# Altium schematic sheet AU0005A_TOP_LEVEL.SchDoc
size D; Organization: Altium Limited; Address1: 3 Minna Close; Address2: Belrose; Address3: NSW 2085; Address4: Australia; DocumentNumber: 1; SheetNumber: 1; SheetTotal: 1; PAGE_TITLE: TOP LEVEL
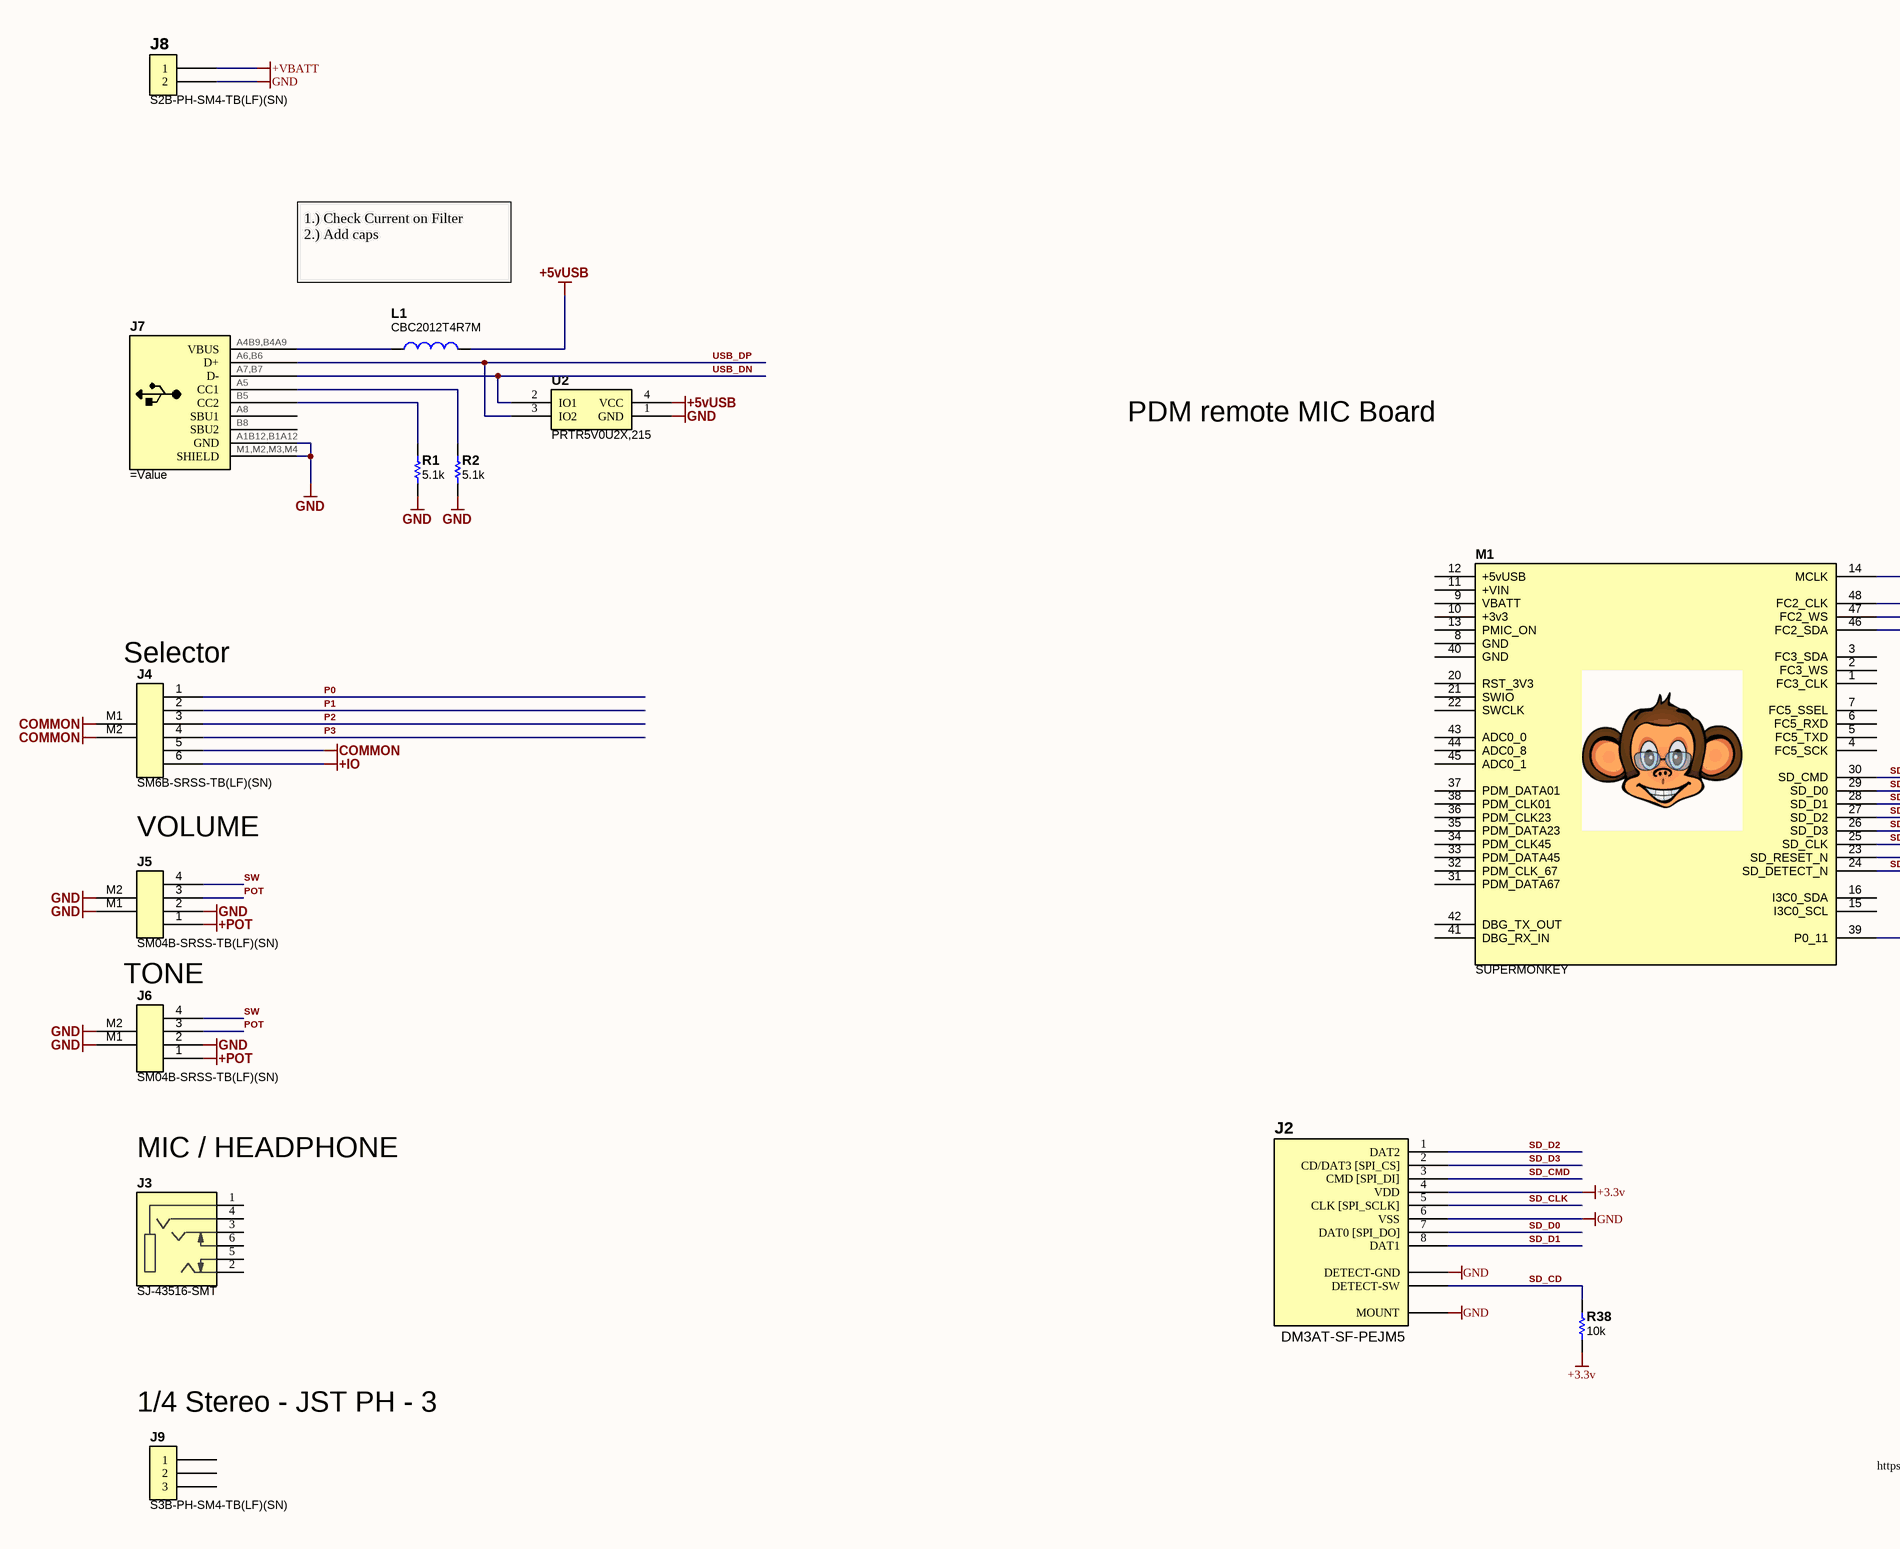
[diagram p0: AU0005A_TOP_LEVEL.SchDoc, left]
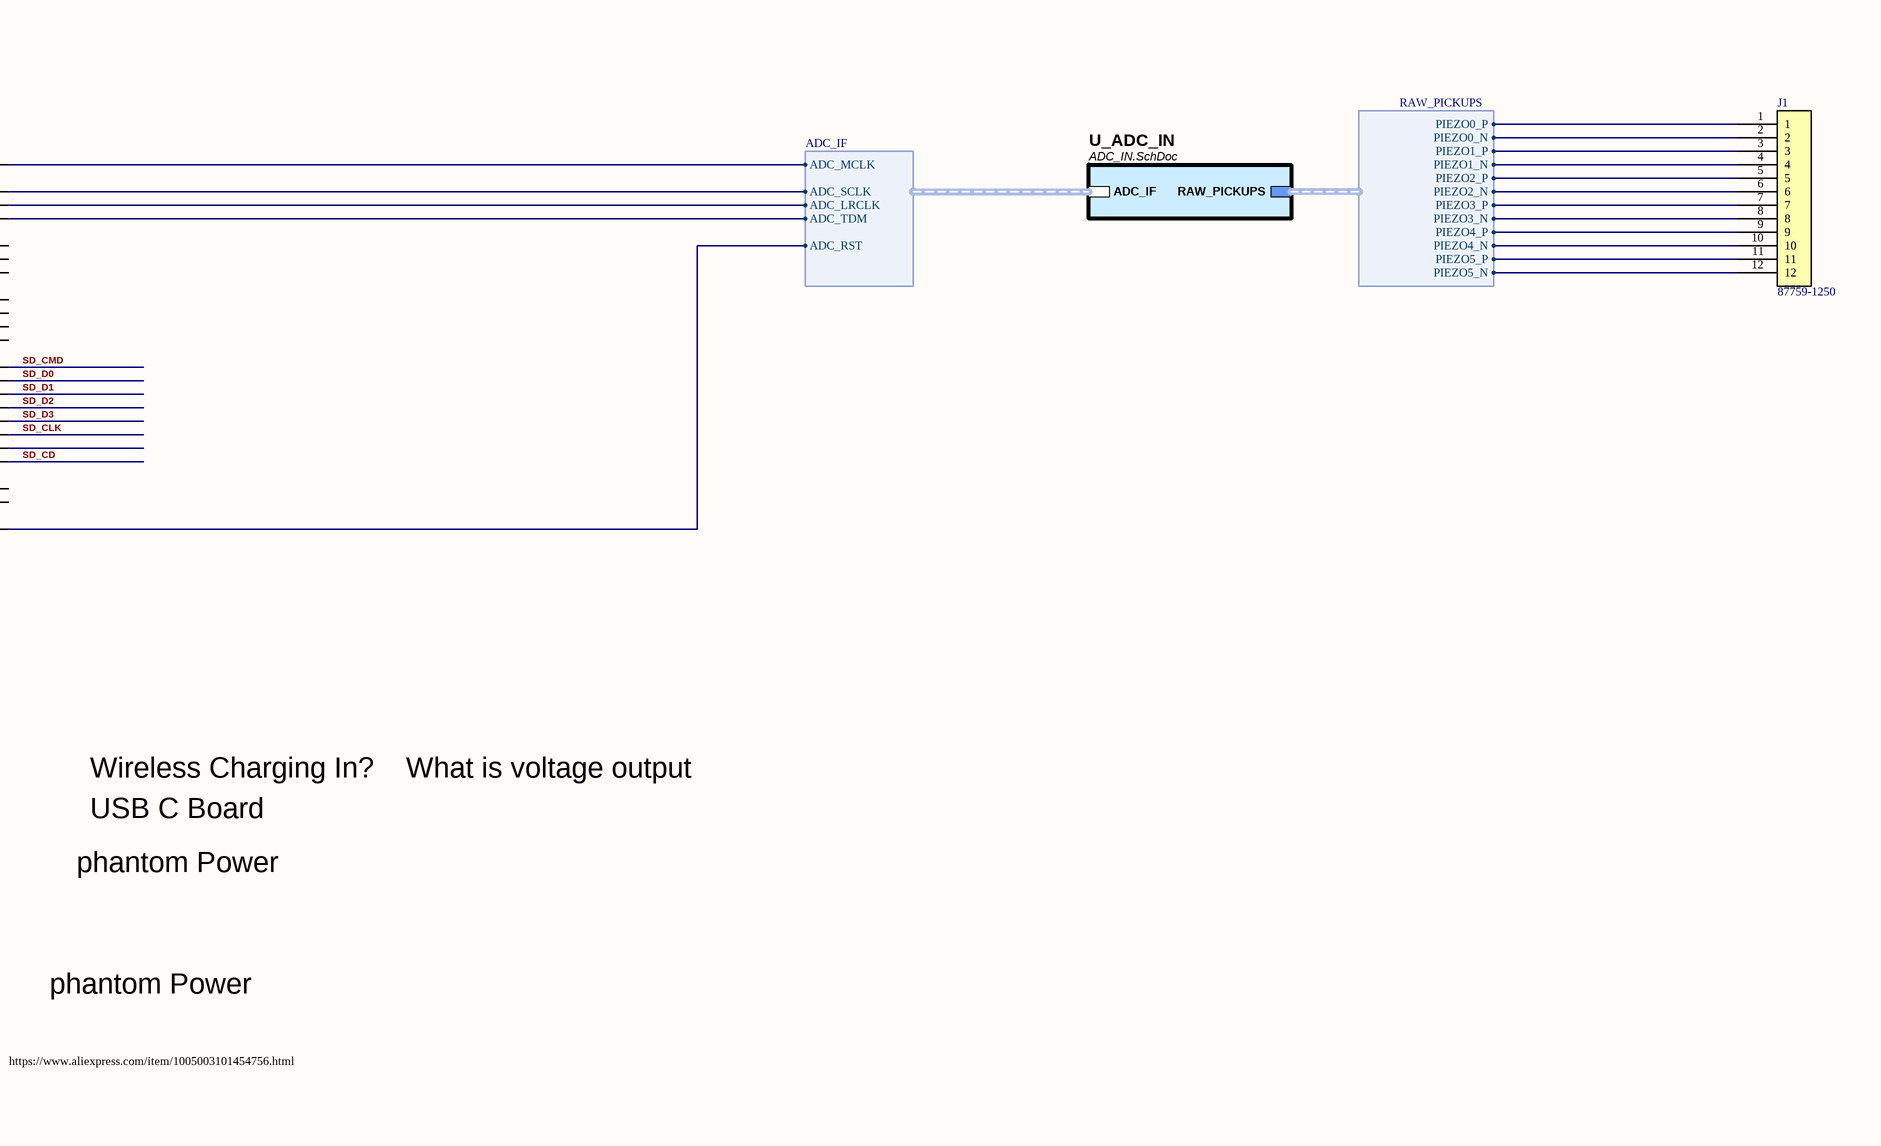
[diagram p1: AU0005A_TOP_LEVEL.SchDoc, right]

## Parts
J1  87759-1250  [87759-1250]
J2  DM3AT-SF-PEJM5  [DM3AT-SF-PEJM5]
J3  SJ-43516-SMT  [CUI_SJ-43516-SMT]
J4  SM6B-SRSS-TB(LF)(SN)  [SM06B-SRSS-TB(LF)(SN)]
J5  SM04B-SRSS-TB(LF)(SN)  [SM04B-SRSS-TB(LF)(SN)]
J6  SM04B-SRSS-TB(LF)(SN)  [SM04B-SRSS-TB(LF)(SN)]
J7  (no value)  [12402012E212A]
J8  S2B-PH-SM4-TB(LF)(SN)  [S2B-PH-SM4-TB(LF)(SN)]
J9  S3B-PH-SM4-TB(LF)(SN)  [S3B-PH-SM4-TB(LF)(SN)]
L1  CBC2012T4R7M  [C0805_1.45MM_MD]
M1  SUPERMONKEY  [SUPERMONKEY]
R1  5.1k  [R0603_0.55MM_MD]
R2  5.1k  [R0603_0.55MM_MD]
R38  10k  [R0402_0.40MM_MD]
U2  PRTR5V0U2X,215  [SOT143B]

## Sub-sheets
U_ADC_IN = ADC_IN.SchDoc: RAW_PICKUPS (harness RAW_PICKUPS), ADC_IF (harness ADC_IF)

## Harnesses
ADC_IF: ADC_MCLK, ADC_LRCLK, ADC_SCLK, ADC_TDM, ADC_RST
RAW_PICKUPS: PIEZO0_N, PIEZO0_P, PIEZO1_P, PIEZO1_N, PIEZO2_P, PIEZO2_N, PIEZO3_P, PIEZO3_N, PIEZO4_P, PIEZO4_N, PIEZO5_P, PIEZO5_N

## Nets
+3.3v: J2.4(VDD) R38.1
+5vUSB: L1.2 U2.4(VCC)
+IO: J4.6
+POT: J5.1 J6.1
+VBATT: J8.1
COMMON: J4.5 J4.M1 J4.M2
GND: J2.6(VSS) J2.CDA(DETECT-GND) J2.M(MOUNT) J5.2 J5.M1 J5.M2 J6.2 J6.M1 J6.M2 J7.A1B12,B1A12(GND) J7.M1,M2,M3,M4(SHIELD) J8.2 R1.1 R2.1 U2.1(GND)
P0: J4.1
P1: J4.2
P2: J4.3
P3: J4.4
POT: J5.3 J6.3
SD_CD: J2.CDB(DETECT-SW) M1.24(SD_DETECT_N) R38.2
SD_CLK: J2.5(CLK_[SPI_SCLK]) M1.25(SD_CLK)
SD_CMD: J2.3(CMD_[SPI_DI]) M1.30(SD_CMD)
SD_D0: J2.7(DAT0_[SPI_DO]) M1.29(SD_D0)
SD_D1: J2.8(DAT1) M1.28(SD_D1)
SD_D2: J2.1(DAT2) M1.27(SD_D2)
SD_D3: J2.2(CD/DAT3_[SPI_CS]) M1.26(SD_D3)
SW: J5.4 J6.4
USB_DN: J7.A7,B7(D-) U2.2(IO1)
USB_DP: J7.A6,B6(D+) U2.3(IO2)
NetJ1_1: J1.1 ; sheet U_ADC_IN/RAW_PICKUPS.PIEZO0_P
NetJ1_2: J1.2 ; sheet U_ADC_IN/RAW_PICKUPS.PIEZO0_N
NetJ1_3: J1.3 ; sheet U_ADC_IN/RAW_PICKUPS.PIEZO1_P
NetJ1_4: J1.4 ; sheet U_ADC_IN/RAW_PICKUPS.PIEZO1_N
NetJ1_5: J1.5 ; sheet U_ADC_IN/RAW_PICKUPS.PIEZO2_P
NetJ1_6: J1.6 ; sheet U_ADC_IN/RAW_PICKUPS.PIEZO2_N
NetJ1_7: J1.7 ; sheet U_ADC_IN/RAW_PICKUPS.PIEZO3_P
NetJ1_8: J1.8 ; sheet U_ADC_IN/RAW_PICKUPS.PIEZO3_N
NetJ1_9: J1.9 ; sheet U_ADC_IN/RAW_PICKUPS.PIEZO4_P
NetJ1_10: J1.10 ; sheet U_ADC_IN/RAW_PICKUPS.PIEZO4_N
NetJ1_11: J1.11 ; sheet U_ADC_IN/RAW_PICKUPS.PIEZO5_P
NetJ1_12: J1.12 ; sheet U_ADC_IN/RAW_PICKUPS.PIEZO5_N
NetJ7_A4B9,B4A9: J7.A4B9,B4A9(VBUS) L1.1
NetJ7_A5: J7.A5(CC1) R2.2
NetJ7_B5: J7.B5(CC2) R1.2
NetM1_14: M1.14(MCLK) ; sheet U_ADC_IN/ADC_IF.ADC_MCLK
NetM1_39: M1.39(P0_11) ; sheet U_ADC_IN/ADC_IF.ADC_RST
NetM1_46: M1.46(FC2_SDA) ; sheet U_ADC_IN/ADC_IF.ADC_TDM
NetM1_47: M1.47(FC2_WS) ; sheet U_ADC_IN/ADC_IF.ADC_LRCLK
NetM1_48: M1.48(FC2_CLK) ; sheet U_ADC_IN/ADC_IF.ADC_SCLK

Not connected (* = marked no-connect by the designer): J3 1(SLEEVE) 2(TIP) 3(RING1) 4(RING2) 5(TIP_SWITCH) 6(RING_SWITCH); J7 A8(SBU1) B8(SBU2); J9 1 2 3; M1 1(FC3_CLK) 2(FC3_WS) 3(FC3_SDA) 4(FC5_SCK) 5(FC5_TXD) 6(FC5_RXD) 7(FC5_SSEL) 8(GND) 9(VBATT) 10(+3v3) 11(+VIN) 12(+5vUSB) 13(PMIC_ON) 15(I3C0_SCL) 16(I3C0_SDA) 20(RST_3V3) 21(SWIO) 22(SWCLK) 23(SD_RESET_N) 31(PDM_DATA67) 32(PDM_CLK_67) 33(PDM_DATA45) 34(PDM_CLK45) 35(PDM_DATA23) 36(PDM_CLK23) 37(PDM_DATA01) 38(PDM_CLK01) 40(GND) 41(DBG_RX_IN) 42(DBG_TX_OUT) 43(ADC0_0) 44(ADC0_8) 45(ADC0_1)

## Notes on the sheet
- 1.) Check Current on Filter
  2.) Add caps
- PDM remote MIC Board
- (near J4) Selector
- VOLUME
- TONE
- (near J3) MIC / HEADPHONE
- Wireless Charging In?    What is voltage output
- USB C Board
- phantom Power
- (near J9) 1/4 Stereo - JST PH - 3
- https://www.aliexpress.com/item/1005003101454756.html
- PCB REV
- CCA REV
- Sheet
- of

## Library data of the parts
J1 = 87759-1250: CONN HEADER 12POS 2MM VERT SMD; Manufacturer: Molex Connector Corporation; Connector Type: Header, Unshrouded; Number of Positions: 12; Number of Positions Loaded: All; Pitch: 0.079" (2.00mm); Value: 87759-1250; Supplier 1: Digi-Key; Supplier Part Number 1: WM18653-ND; Manufacturer Part Number: 87759-1250; RoHS: RoHS Compliant; Category: Connectors, Interconnects; Stock 1: 1595; Pricing 1: 1=2.07, 10=1.823, 100=1.2155, 500=0.9724, 1000=0.80709 (USD); Contact Type: Male Pin; Number of Rows: 2; Row Spacing: 0.079" (2.00mm); Contact Mating Length: 0.150" (3.81mm); Mounting Type: Surface Mount; Termination: Solder; Fastening Type: -; Features: Board Guide; Contact Finish: Gold; Contact Finish Thickness: 15µin (0.38µm); Color: Black; Packaging: Tube; ComponentLink1URL: http://www.molex.com/pdm_docs/sd/877591250_sd.pdf; ComponentLink1Description: http://www.molex.com/pdm_docs/sd/877591250_sd.pdf
J2 = DM3AT-SF-PEJM5: CONN MICRO SD R/A PUSH-PUSH SMD; Manufacturer: Hirose Electric Co Ltd; Card Type: Secure Digital - microSD™; Number of Positions: 10 (8 + 2); Connector Type: Connector and Ejector; Insertion, Removal Method: Push In, Push Out; Supplier 1: Digi-Key; Supplier Part Number 1: HR1964CT-ND; Manufacturer Part Number: DM3AT-SF-PEJM5; RoHS: RoHS Compliant; Category: Connectors, Interconnects; Stock: 28699; Pricing: 1=2.83, 10=2.72, 25=2.4932, 50=2.3798, 100=2.2664, 250=1.98312, 500=1.92648 (USD); Packaging: Cut Tape (CT); Ejector Side: -; Mounting Type: Surface Mount, Right Angle; Features: Switch; Height Above Board: 0.066" (1.68mm); Mounting Feature: Normal, Standard - Top; Contact Finish: Gold; Contact Finish Thickness: -; ComponentLink1URL: http://www.hirose.co.jp/cataloge_hp/e60900232.pdf; ComponentLink1Description: http://www.hirose.co.jp/cataloge_hp/e60900232.pdf; Value: DM3AT-SF-PEJM5
J3 = SJ-43516-SMT: Conn 3.5MM Audio Jack F 6 POS Solder RA SMD 6 Terminal 1 Port; Manufacturer: CUI Devices; Manufacturer Part Number: SJ-43516-SMT-TR; Value: SJ-43516-SMT; Package: 3.5MM SMD R/A; Price: $1.24; Availability: Available
J4 = SM06B-SRSS-TB(LF)(SN): 6 Positions Header, Shrouded Connector 0.039" (1.00mm) Surface Mount, Right Angle Tin; Manufacturer: JST; Number of Positions: 6; Connector Type: Male Pin; Contact Resistance: 40mR; Pitch: 1mm; Current Rating: 1A; Voltage Rating (AC): 50V; Insulation Resistance: 100MR; Gender: Male; Value: SM6B-SRSS-TB(LF)(SN); Supplier 1: Digi-Key; Manufacturer Part Number: SM06B-SRSS-TB(LF)(SN); Stock 1: 40560; Pricing 1: 1=0.83, 10=0.782, 100=0.5996, 500=0.5214, 1000=0.4301 (USD); Mount: Surface Mount; Contact Material: Copper,Copper Alloy; Contact Plating: Copper,Tin,Lead; Colour: Natural; Housing Colour: Beige; Housing Material: Polyamide; Min Operating Temperature: -25°C; Max Operating Temperature: 85°C; Number of Rows: 1; Termination: Solder; Packaging: Tape and Reel; Orientation: Right Angle; Number of Contacts: 6; Lead Free: Lead Free; ComponentLink1URL: https://datasheet.ciiva.com/11752/0900766b8082f544-11752176.pdf; ComponentLink1Description: https://datasheet.ciiva.com/11752/0900766b8082f544-11752176.pdf; ComponentLink2URL: https://datasheet.ciiva.com/16217/sm06b-srss-tblfsn-16217552.pdf; ComponentLink2Description: https://datasheet.ciiva.com/16217/sm06b-srss-tblfsn-16217552.pdf; ComponentLink3URL: https://datasheet.ciiva.com/26894/getdatasheetpartid-490708-26894951.pdf; ComponentLink3Description: https://datasheet.ciiva.com/26894/getdatasheetpartid-490708-26894951.pdf; Supplier Part Number 1: 455-1806-1-ND; Material: Polyamide; Voltage Rating: 50V; Lead Pitch: 1mm; REACH SVHC: No SVHC; Flammability Rating: UL94 V-0; ComponentLink4URL: https://datasheet.ciiva.com/26894/getdatasheetpartid-639890-26894680.pdf; ComponentLink4Description: https://datasheet.ciiva.com/26894/getdatasheetpartid-639890-26894680.pdf; ComponentLink5URL: https://datasheet.ciiva.com/8052/91630-8052281.pdf; ComponentLink5Description: https://datasheet.ciiva.com/8052/91630-8052281.pdf; ComponentLink6URL: https://datasheet.ciiva.com/712/esr-712571.pdf; ComponentLink6Description: https://datasheet.ciiva.com/712/esr-712571.pdf; Max Current Rating: 1A; Max Voltage Rating (AC): 50V; Max Voltage Rating (DC): 50V; Length: 8mm; Depth: 4.95mm; ComponentLink7URL: https://datasheet.ciiva.com/712/esr-712572.pdf; ComponentLink7Description: https://datasheet.ciiva.com/712/esr-712572.pdf; ComponentLink8URL: https://datasheet.ciiva.com/730/esr-730671.pdf; ComponentLink8Description: https://datasheet.ciiva.com/730/esr-730671.pdf
J5 J6 = SM04B-SRSS-TB(LF)(SN): Conn Shrouded Header HDR 4 POS 1mm Solder RA SMD T/R; Manufacturer: JST; Number of Positions: 4; Connector Type: Male Pin; Contact Resistance: 40mR; Max Current Rating: 1A; Max Voltage Rating (AC): 50V; Pitch: 0.039inch; Value: SM04B-SRSS-TB(LF)(SN); Supplier 1: Digi-Key; Manufacturer Part Number: SM04B-SRSS-TB(LF)(SN); Stock 1: 43886; Pricing 1: 1=0.61, 10=0.569, 100=0.436, 500=0.37914, 1000=0.31279 (USD); Mount: Surface Mount; Contact Material: Copper Alloy; Contact Plating: Copper,Tin; Colour: Natural; Housing Colour: Beige; Housing Material: Polyamide; Min Operating Temperature: -25°C; Max Operating Temperature: 85°C; Number of Rows: 1; Termination: Solder; Packaging: Tape and Reel; Orientation: Right Angle; Number of Contacts: 4; Max Voltage Rating (DC): 50V; Length: 6mm; Depth: 4.95mm; Lead Free: Lead Free; ComponentLink1URL: https://datasheet.ciiva.com/26894/getdatasheetpartid-499363-26894945.pdf; ComponentLink1Description: https://datasheet.ciiva.com/26894/getdatasheetpartid-499363-26894945.pdf; ComponentLink2URL: https://datasheet.ciiva.com/26894/getdatasheetpartid-640736-26894676.pdf; ComponentLink2Description: https://datasheet.ciiva.com/26894/getdatasheetpartid-640736-26894676.pdf; ComponentLink3URL: https://datasheet.ciiva.com/16487/jstsm04b-srss-tb-lf-sn-16487222.pdf; ComponentLink3Description: https://datasheet.ciiva.com/16487/jstsm04b-srss-tb-lf-sn-16487222.pdf; Supplier Part Number 1: 455-1804-1-ND
J7 = 12402012E212A: Manufacturer: Amphenol; Supplier 1: Mouser; Supplier Part Number 1: 523-12402012E212A; Manufacturer Part Number: 12402012E212A; RoHS: No; Category: Connectors; Stock 1: 6869; Pricing: 1=0.98000, 10=0.77400, 50=0.77400, 100=0.67300, 1000=0.53800, 10000=0.43700 (USD)
J8 = S2B-PH-SM4-TB(LF)(SN): CONN HEADER PH SIDE 2POS 2MM SMD; Manufacturer: JST Sales America Inc; Connector Type: Header, Shrouded; Number of Positions: 2; Number of Positions Loaded: All; Pitch: 0.079" (2.00mm); Value: S2B-PH-SM4-TB(LF)(SN); Supplier 1: Digi-Key; Supplier Part Number 1: 455-1749-1-ND; Manufacturer Part Number: S2B-PH-SM4-TB(LF)(SN); RoHS: RoHS Compliant; Category: Connectors, Interconnects; Stock 1: 17700; Pricing 1: 1=0.5, 10=0.457, 100=0.3809, 500=0.3047 (USD); Contact Type: Male Pin; Number of Rows: 1; Row Spacing: -; Contact Mating Length: -; Mounting Type: Surface Mount, Right Angle; Termination: Solder; Fastening Type: -; Features: Solder Retention; Contact Finish: Tin; Contact Finish Thickness: -; Color: Natural; Packaging: Cut Tape (CT); ComponentLink1URL: http://www.jst-mfg.com/product/pdf/eng/ePH.pdf; ComponentLink1Description: http://www.jst-mfg.com/product/pdf/eng/ePH.pdf
J9 = S3B-PH-SM4-TB(LF)(SN): CONN HEADER PH SIDE 3POS 2MM SMD; Manufacturer: JST Sales America Inc; Value: S3B-PH-SM4-TB(LF)(SN); Manufacturer Part Number: S3B-PH-SM4-TB(LF)(SN)
L1 = CBC2012T4R7M: FIXED IND 4.7UH 520MA 650 MOHM; Manufacturer: Taiyo Yuden; Core Material: Ferrite; Tolerance: 20%; Self Resonant Frequency: 45MHz; DC Resistance (DCR): 650mR; Test Frequency: 7.96MHz; Saturation Current: 360mA; Shielding: Unshielded; Value: CBC2012T4R7M; Supplier 1: Digi-Key; Manufacturer Part Number: CBC2012T4R7M; Stock 1: 7720; Pricing 1: 1=0.24000, 10=0.21600, 100=0.14860, 500=0.12702, 1000=0.09729 (USD); RoHS: Yes; Mount: Surface Mount; Case/Package: 0805; Number of Pins: 2; Case Code (Metric): 2012; Case Code (Imperial): 0805; Min Operating Temperature: -40°C; Max Operating Temperature: 105°C; Packaging: Tape and Reel; Inductance: 4.7uH; Max DC Current: 520mA; Termination: SMD/SMT; Inductance Tolerance: 20%; Package Quantity: 3000; Current Rating: 520mA; Composition: Wirewound; Length: 0.079inch; Height: 1.25mm; Width: 0.049inch; Height - Seated (Max): 0.057inch; REACH SVHC: No SVHC; Lead Free: Exempt; Halogen Free: Halogen Free; ComponentLink1URL: https://datasheet.ciiva.com/15981/214cbc2012t4r7m-15981637.pdf?src-supplier=Onlinecomponents.com; ComponentLink1Description: https://datasheet.ciiva.com/15981/214cbc2012t4r7m-15981637.pdf?src-supplier=Onlinecomponents.com; ComponentLink2URL: https://datasheet.ciiva.com/1040/cbc2012t4r7m-ss-1040456.pdf?src-supplier=Digi-Key; ComponentLink2Description: https://datasheet.ciiva.com/1040/cbc2012t4r7m-ss-1040456.pdf?src-supplier=Digi-Key; ComponentLink3URL: https://datasheet.ciiva.com/8505/cbc2012t4r7m-ss-8505656.pdf?src-supplier=Avnet; ComponentLink3Description: https://datasheet.ciiva.com/8505/cbc2012t4r7m-ss-8505656.pdf?src-supplier=Avnet; ComponentLink4URL: https://datasheet.ciiva.com/8001/wound02-e-8001849.pdf?src-supplier=Element14; ComponentLink4Description: https://datasheet.ciiva.com/8001/wound02-e-8001849.pdf?src-supplier=Element14; Supplier Part Number 1: 587-1602-1-ND
R1 R2 = ERJ-3EKF5101V: RES 5.1K OHM 1/10W 1% 0603 SMD; Manufacturer: Panasonic Electronic Components; Package Power: 0603  (0.1W); Power (Watts): 0.1W- 1/10W; Temperature Coefficient: ±100ppm/°C; Limiting Element Voltage: 75; Maximum Overload Voltage: 150; Maximum Working Voltage: 22.6V; Substitution Notes: 5.1k , ±1% , 0603 , AEC-Q200; Value: 5.1k; Manufacturer Part Number: ERJ-3EKF5101V; ComponentLink1Description: Internal Datasheet; ComponentLink1URL: datasheets\Panasonic Electronic Components\AOA0000CE2.pdf; ComponentLink2Description: External Datasheet; ComponentLink2URL: http://industrial.panasonic.com/www-data/pdf/AOA0000/AOA0000CE2.pdf; Supplier 1: Digi-Key; Supplier Part Number 1: P5.10KHCT-ND; Category: Resistors; Resistance (Ohms): 5.1k; Composition: Thick Film; Features: -; Tolerance: ±1%; Package: 0603 (1608 Metric); Supplier Package: 0603; Size / Dimension: 0.063" L x 0.031" W (1.60mm x 0.80mm); Height: 0.55MM; Number of Terminations: 2; Packaging: Cut Tape (CT); Sort Value: 5100; Sort Value Package: 603_5100; Ratings: AEC-Q200
R38 = ERJ-2RKF1002X: RES 10K OHM 1/10W 1% 0402 SMD; Manufacturer: Panasonic Electronic Components; Package Power: 0402  (0.1W); Power (Watts): 0.1W- 1/10W; Temperature Coefficient: ±100ppm/°C; Limiting Element Voltage: 50; Maximum Overload Voltage: 100; Maximum Working Voltage: 31.6V; Substitution Notes: 10k , ±1% , 0402 , AEC-Q200; Value: 10k; Manufacturer Part Number: ERJ-2RKF1002X; ComponentLink1Description: Internal Datasheet; ComponentLink1URL: datasheets\Panasonic Electronic Components\AOA0000CE2.pdf; ComponentLink2Description: External Datasheet; ComponentLink2URL: http://industrial.panasonic.com/www-data/pdf/AOA0000/AOA0000CE2.pdf; Supplier 1: Digi-Key; Supplier Part Number 1: P10.0KLCT-ND; Category: Resistors; Resistance (Ohms): 10k; Composition: Thick Film; Features: -; Tolerance: ±1%; Package: 0402 (1005 Metric); Supplier Package: 0402; Size / Dimension: 0.039" L x 0.020" W (1.00mm x 0.50mm); Height: 0.40MM; Number of Terminations: 2; Packaging: Cut Tape (CT); Sort Value: 10000; Sort Value Package: 402_10000; Ratings: AEC-Q200
U2 = PRTR5V0U2X,215: TVS DIODE 5.5VWM SOT143B; Manufacturer: NXP Semiconductors; Bidirectional Channels: 2; Voltage - Reverse Standoff (Typ): 5.5V (Max); Voltage - Breakdown (Min): 6V; Power Line Protection: Yes; Capacitance @ Frequency: 1pF @ 1MHz; Supplier 1: Digi-Key; Supplier Part Number 1: 568-4140-1-ND; Manufacturer Part Number: PRTR5V0U2X,215; RoHS: RoHS Compliant; Category: Circuit Protection; Stock: 11734; Pricing: 1=0.57, 10=0.477, 25=0.418, 100=0.3578, 250=0.31036, 500=0.26286, 1000=0.20265 (USD); Packaging: Cut Tape (CT); Type: Steering (Rail to Rail); Unidirectional Channels: -; Voltage - Clamping (Max) @ Ipp: -; Current - Peak Pulse (10/1000µs): -; Power - Peak Pulse: -; Applications: General Purpose; Operating Temperature: -40°C ~ 85°C (TA); Mounting Type: Surface Mount; Package / Case: TO-253-4, TO-253AA; Supplier Device Package: SOT-143B; ComponentLink1URL: http://www.nxp.com/documents/data_sheet/PRTR5V0U2X.pdf; ComponentLink1Description: http://www.nxp.com/documents/data_sheet/PRTR5V0U2X.pdf; Value: PRTR5V0U2X,215